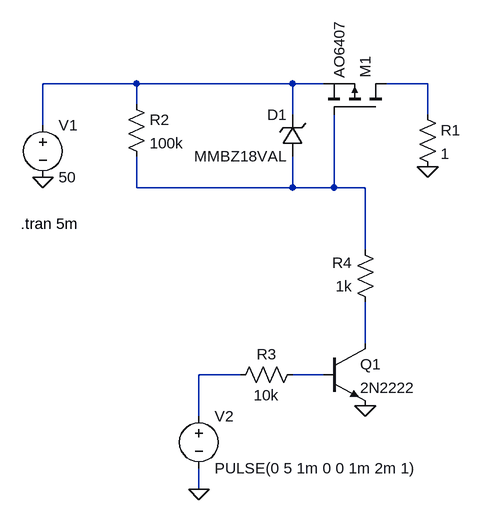
[diagram p0: schematic pmos_high_side_switch.asc]
pmos_high_side_switch.asc, the LTspice schematic file:
Version 4
SHEET 1 880 788
WIRE 176 144 32 144
WIRE 416 144 176 144
WIRE 464 144 416 144
WIRE 624 144 560 144
WIRE 176 176 176 144
WIRE 416 192 416 144
WIRE 624 192 624 144
WIRE 32 208 32 144
WIRE 176 304 176 256
WIRE 416 304 416 256
WIRE 416 304 176 304
WIRE 480 304 480 192
WIRE 480 304 416 304
WIRE 528 304 480 304
WIRE 528 400 528 304
WIRE 528 544 528 480
WIRE 336 592 272 592
WIRE 464 592 416 592
WIRE 272 656 272 592
WIRE 272 768 272 736
FLAG 32 288 0
FLAG 624 272 0
FLAG 272 768 0
FLAG 528 640 0
SYMBOL pmos 560 192 M270
SYMATTR InstName M1
SYMATTR Value AO6407
SYMBOL voltage 32 192 R0
WINDOW 123 0 0 Left 0
WINDOW 39 24 124 Left 2
SYMATTR InstName V1
SYMATTR Value 50
SYMBOL res 608 176 R0
SYMATTR InstName R1
SYMATTR Value 1
SYMBOL res 160 160 R0
SYMATTR InstName R2
SYMATTR Value 100k
SYMBOL zener 432 256 R180
WINDOW 0 24 64 Left 2
WINDOW 3 24 0 Left 2
SYMATTR InstName D1
SYMATTR Value MMBZ18VAL
SYMATTR Description Diode
SYMATTR Type diode
SYMBOL voltage 272 640 R0
WINDOW 123 0 0 Left 0
WINDOW 39 0 0 Left 0
SYMATTR InstName V2
SYMATTR Value PULSE(0 5 1m 0 0 1m 2m 1)
SYMBOL res 432 576 R90
WINDOW 0 0 56 VBottom 2
WINDOW 3 32 56 VTop 2
SYMATTR InstName R3
SYMATTR Value 10k
SYMBOL npn 464 544 R0
SYMATTR InstName Q1
SYMATTR Value 2N2222
SYMBOL res 544 496 R180
WINDOW 0 36 76 Left 2
WINDOW 3 36 40 Left 2
SYMATTR InstName R4
SYMATTR Value 1k
TEXT -2 360 Left 2 !.tran 5m

The netlist it stands for:
* pmos_high_side_switch.asc
M1 N002 N003 N001 N001 AO6407
V1 N001 0 50
R1 N002 0 1
R2 N001 N003 100k
D1 N003 N001 MMBZ18VAL
V2 N005 0 PULSE(0 5 1m 0 0 1m 2m 1)
R3 N006 N005 10k
Q1 N004 N006 0 0 2N2222
R4 N004 N003 1k
.model D D
.lib standard.dio
.model NPN NPN
.model PNP PNP
.lib standard.bjt
.model NMOS NMOS
.model PMOS PMOS
.lib standard.mos
.tran 5m
.backanno
.end